# Altium schematic sheet Raspberry_pi_hat.SchDoc
size A; SheetNumber: 7; SheetTotal: 8
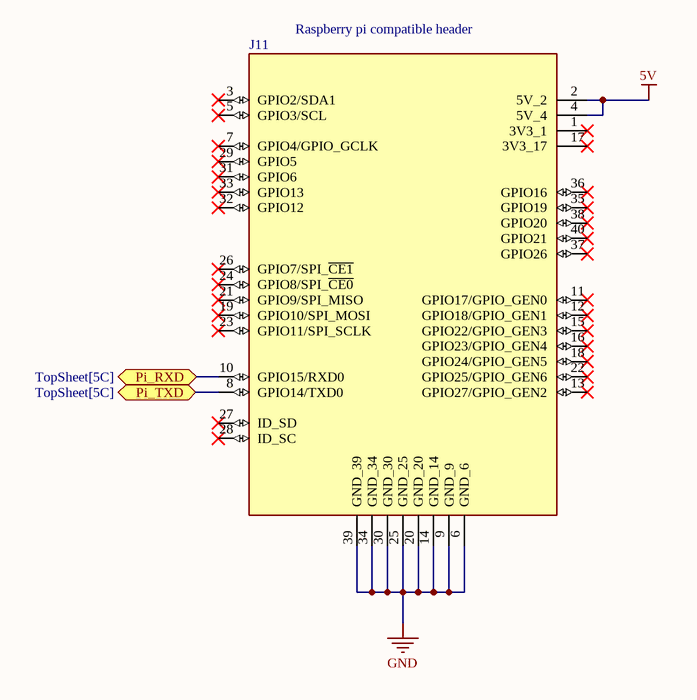
[diagram p0: Raspberry_pi_hat.SchDoc]

## Parts
J11  Raspberry pi compatible header  [pi_header]

## Ports
Pi_RXD (bidir, see TopSheet[5C]), Pi_TXD (bidir, see TopSheet[5C])

## Nets
5V: J11.2(5V_2) J11.4(5V_4)
GND: J11.6(GND_6) J11.9(GND_9) J11.14(GND_14) J11.20(GND_20) J11.25(GND_25) J11.30(GND_30) J11.34(GND_34) J11.39(GND_39)
Pi_RXD: J11.10(GPIO15/RXD0) ; port Pi_RXD
Pi_TXD: J11.8(GPIO14/TXD0) ; port Pi_TXD

Not connected (* = marked no-connect by the designer): J11 1(3V3_1)* 3(GPIO2/SDA1)* 5(GPIO3/SCL)* 7(GPIO4/GPIO_GCLK)* 11(GPIO17/GPIO_GEN0)* 12(GPIO18/GPIO_GEN1)* 13(GPIO27/GPIO_GEN2)* 15(GPIO22/GPIO_GEN3)* 16(GPIO23/GPIO_GEN4)* 17(3V3_17)* 18(GPIO24/GPIO_GEN5)* 19(GPIO10/SPI_MOSI)* 21(GPIO9/SPI_MISO)* 22(GPIO25/GPIO_GEN6)* 23(GPIO11/SPI_SCLK)* 24(GPIO8/SPI_~{CE0})* 26(GPIO7/SPI_~{CE1})* 27(ID_SD)* 28(ID_SC)* 29(GPIO5)* 31(GPIO6)* 32(GPIO12)* 33(GPIO13)* 35(GPIO19)* 36(GPIO16)* 37(GPIO26)* 38(GPIO20)* 40(GPIO21)*

## Library data of the parts
J11 = pi_header